# Altium schematic sheet 01-FPGA_Sources.SchDoc
size A4; Author: Fabian Castaño; CompanyName: GIBIC Tech-Hub; Engineer: Fabian Castaño; Organization: Universidad de Antioquia; Address1: UdeA; Address2: Medellín; Address3: Antioquia; Address4: Colombia 050010
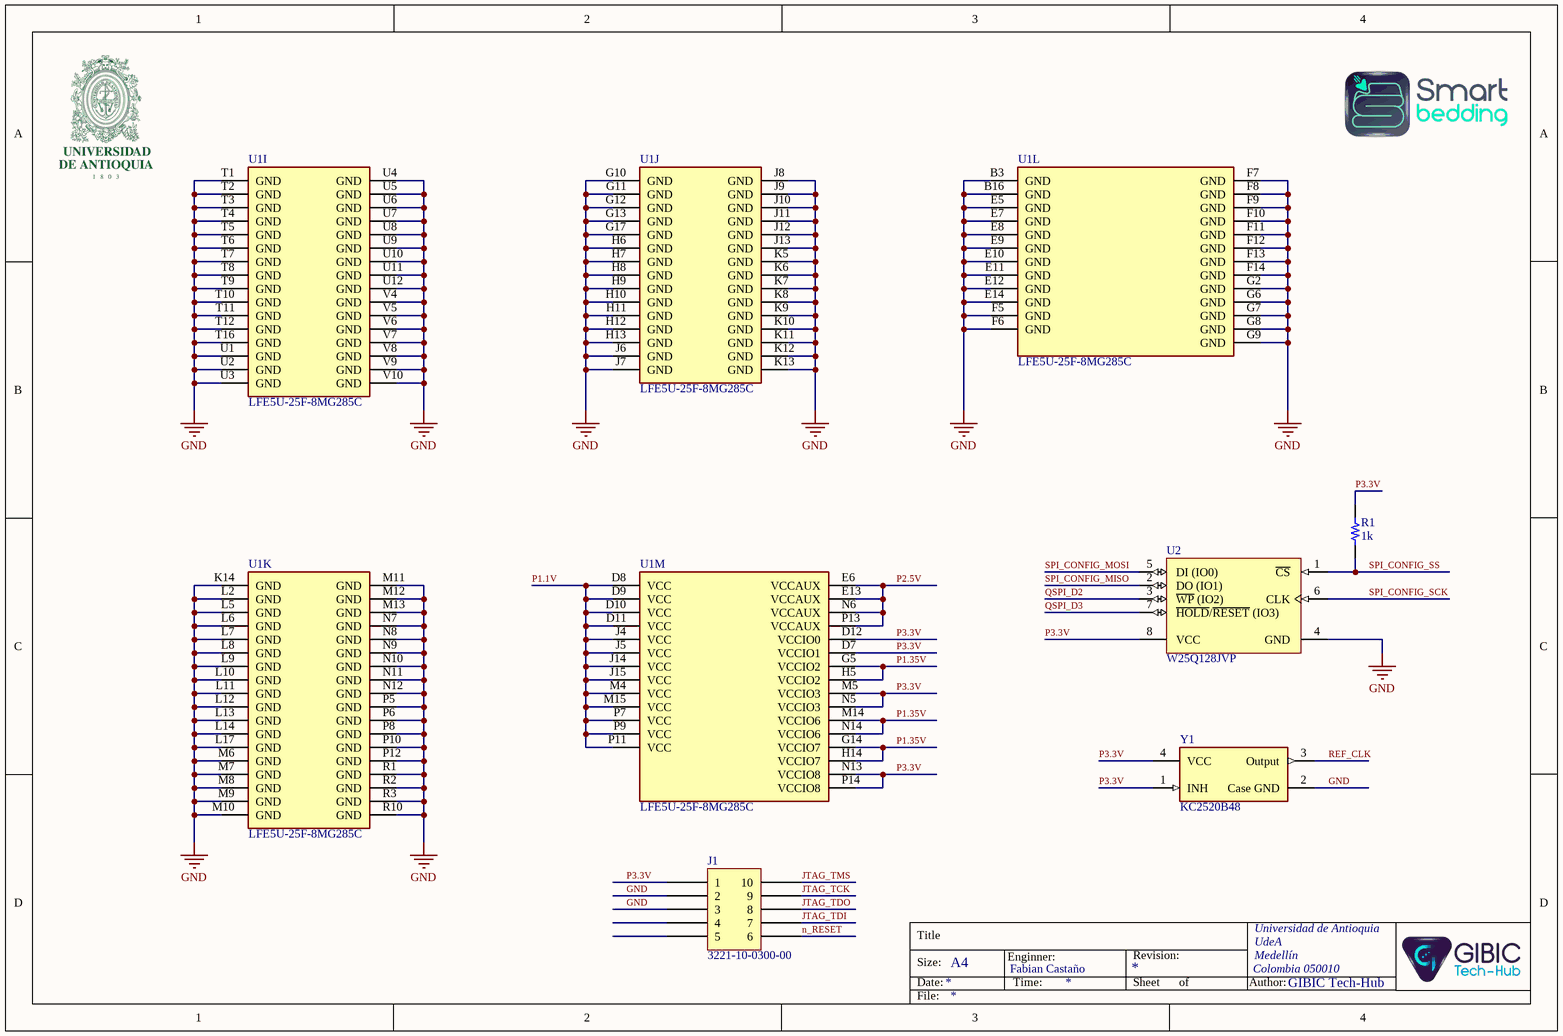
[diagram p0: 01-FPGA_Sources.SchDoc]

## Parts
J1  3221-10-0300-00  [CNC TECH 3221-10-0300-00]
R1  1k  [RES 0201_0603]
U1  LFE5U-25F-8MG285C  [FP-cBGA-LFE5U]  (parts I,J,K,L,M of 13)
U2  W25Q128JVP  [SON127P500X600X80-9N]
Y1  KC2520B48  [FP-KC2520B-MFG]

## Nets
GND: J1.2 J1.3 U1.B3(GND) U1.B16(GND) U1.E5(GND) U1.E7(GND) U1.E8(GND) U1.E9(GND) U1.E10(GND) U1.E11(GND) U1.E12(GND) U1.E14(GND) U1.F5(GND) U1.F6(GND) U1.F7(GND) U1.F8(GND) U1.F9(GND) U1.F10(GND) U1.F11(GND) U1.F12(GND) U1.F13(GND) U1.F14(GND) U1.G2(GND) U1.G6(GND) U1.G7(GND) U1.G8(GND) U1.G9(GND) U1.G10(GND) U1.G11(GND) U1.G12(GND) U1.G13(GND) U1.G17(GND) U1.H6(GND) U1.H7(GND) U1.H8(GND) U1.H9(GND) U1.H10(GND) U1.H11(GND) U1.H12(GND) U1.H13(GND) U1.J6(GND) U1.J7(GND) U1.J8(GND) U1.J9(GND) U1.J10(GND) U1.J11(GND) U1.J12(GND) U1.J13(GND) U1.K5(GND) U1.K6(GND) U1.K7(GND) U1.K8(GND) U1.K9(GND) U1.K10(GND) U1.K11(GND) U1.K12(GND) U1.K13(GND) U1.K14(GND) U1.L2(GND) U1.L5(GND) U1.L6(GND) U1.L7(GND) U1.L8(GND) U1.L9(GND) U1.L10(GND) U1.L11(GND) U1.L12(GND) U1.L13(GND) U1.L14(GND) U1.L17(GND) U1.M6(GND) U1.M7(GND) U1.M8(GND) U1.M9(GND) U1.M10(GND) U1.M11(GND) U1.M12(GND) U1.M13(GND) U1.N7(GND) U1.N8(GND) U1.N9(GND) U1.N10(GND) U1.N11(GND) U1.N12(GND) U1.P5(GND) U1.P6(GND) U1.P8(GND) U1.P10(GND) U1.P12(GND) U1.R1(GND) U1.R2(GND) U1.R3(GND) U1.R10(GND) U1.T1(GND) U1.T2(GND) U1.T3(GND) U1.T4(GND) U1.T5(GND) U1.T6(GND) U1.T7(GND) U1.T8(GND) U1.T9(GND) U1.T10(GND) U1.T11(GND) U1.T12(GND) U1.T16(GND) U1.U1(GND) U1.U2(GND) U1.U3(GND) U1.U4(GND) U1.U5(GND) U1.U6(GND) U1.U7(GND) U1.U8(GND) U1.U9(GND) U1.U10(GND) U1.U11(GND) U1.U12(GND) U1.V4(GND) U1.V5(GND) U1.V6(GND) U1.V7(GND) U1.V8(GND) U1.V9(GND) U1.V10(GND) U2.4(GND) Y1.2(Case_GND)
JTAG_TCK: J1.9
JTAG_TDI: J1.7
JTAG_TDO: J1.8
JTAG_TMS: J1.10
n_RESET: J1.6
P1.1V: U1.D8(VCC) U1.D9(VCC) U1.D10(VCC) U1.D11(VCC) U1.J4(VCC) U1.J5(VCC) U1.J14(VCC) U1.J15(VCC) U1.M4(VCC) U1.M15(VCC) U1.P7(VCC) U1.P9(VCC) U1.P11(VCC)
P1.35V: U1.G5(VCCIO2) U1.G14(VCCIO7) U1.H5(VCCIO2) U1.H14(VCCIO7) U1.M14(VCCIO6) U1.N14(VCCIO6)
P2.5V: U1.E6(VCCAUX) U1.E13(VCCAUX) U1.N6(VCCAUX) U1.P13(VCCAUX)
P3.3V: J1.1 R1.1 U1.D7(VCCIO1) U1.D12(VCCIO0) U1.M5(VCCIO3) U1.N5(VCCIO3) U1.N13(VCCIO8) U1.P14(VCCIO8) U2.8(VCC) Y1.1(INH) Y1.4(VCC)
QSPI_D2: U2.3(~{WP}_(IO2))
QSPI_D3: U2.7(~{HOLD}/~{RESET}_(IO3))
REF_CLK: Y1.3(Output)
SPI_CONFIG_MISO: U2.2(DO_(IO1))
SPI_CONFIG_MOSI: U2.5(DI_(IO0))
SPI_CONFIG_SCK: U2.6(CLK)
SPI_CONFIG_SS: R1.2 U2.1(~{CS})

Not connected (* = marked no-connect by the designer): J1 4 5

## Notes on the sheet
- Title
- Size:
- Date:
- A4
- Enginner:
- Time:
- Revision:
- Sheet
- of
- Author:
- File:

## Library data of the parts
J1 = 3221-10-0300-00: CONN HEADER SMD 10POS 1.27MM; Manufacturer: CNC Tech; Current Rating (Amps): 1A; Material Flammability Rating: UL94 V-0; Number of Positions: 10; Number of Positions Loaded: All; Pitch - Mating: 0.050" (1.27mm); Shrouding: Shrouded - 4 Wall; Style: Board to Cable/Wire; Part Number: 3221-10-0300-00; ComponentLink1Description: Datasheet; ComponentLink1URL: http://cnctech.us/idcmatching2.pdf; ComponentLink2Description: DigiKey Link; ComponentLink2URL: http://digikey.com/product-detail/en/cnc-tech/3221-10-0300-00/1175-1735-ND/4878946; Connector Type: Header; Contact Finish - Mating: Gold; Contact Finish - Post: Gold; Contact Finish Thickness - Mating: Flash; Contact Material: Brass; Contact Shape: Square; Contact Type: Male Pin; Fastening Type: Push-Pull; Features: Keying Slot; Insulation Height: 0.213" (5.40mm); Insulation Material: Polyamide (PA6T), Nylon 6T; LastUpdated: 13/01/2020 12:09:21 a. m.; Lifecycle Status: Active; Minimum Order: 1; Mounting Type: Surface Mount; Number of Rows: 2; Operating Temperature: -40°C ~ 105°C; Packaging: Tray; PartId: 109; Part Status: Active; Price: 0.73; Row Spacing - Mating: 0.050" (1.27mm); Series: -; Supplier 1: DigiKey; Supplier Part Number 1: 1175-1735-ND; Termination: Solder
R1 = ERA-1AEB103C: RES SMD 10K OHM 0.1% 1/20W 0201; Manufacturer: Panasonic Electronic Components; Power (Watts): 0.05W, 1/20W; Resistance: 10 kOhms; Temperature Coefficient: ±25ppm/°C; Part Number: ERA-1AEB103C; Value: 1k; ComponentLink1Description: Datasheet; ComponentLink1URL: https://industrial.panasonic.com/cdbs/www-data/pdf/RDM0000/AOA0000C307.pdf; ComponentLink2Description: DigiKey Link; ComponentLink2URL: https://www.digikey.com/en/products/detail/panasonic-electronic-components/ERA-1AEB103C/5035568; Composition: Thin Film; Device Package: 0201 (0603 Metric); Features: Automotive AEC-Q200; Height - Seated (Max): 0.010" (0.26mm); LastUpdated: 3/01/2023 8:15:23 p. m.; Lifecycle Status: Active; Minimum Order: 1; Number of Terminations: 2; Operating Temperature: -55°C ~ 155°C; Package / Case: 0201 (0603 Metric); Packaging: TapeAndReel; PartId: 598; Part Status: Active; Price: 0.06; Ratings: AEC-Q200; Series: ERA-1A; Size / Dimension: 0.024" L x 0.012" W (0.60mm x 0.30mm); Supplier 1: DigiKey; Supplier Part Number 1: P10KBXCT-ND; Supplier Device Package: 0201; Tolerance: ±0.1%
U1 = LFE5U-25F-8MG285C: FPGA LatticeECP5 Family 24000 Cells 40nm Technology 1.1V 285-Pin CSFBGA
U2 = W25Q128JVP: FLASH - NOR Memory IC 128Mb (16M x 8) SPI - Quad I/O, QPI, DTR 133 MHz 8-WSON (6x5)